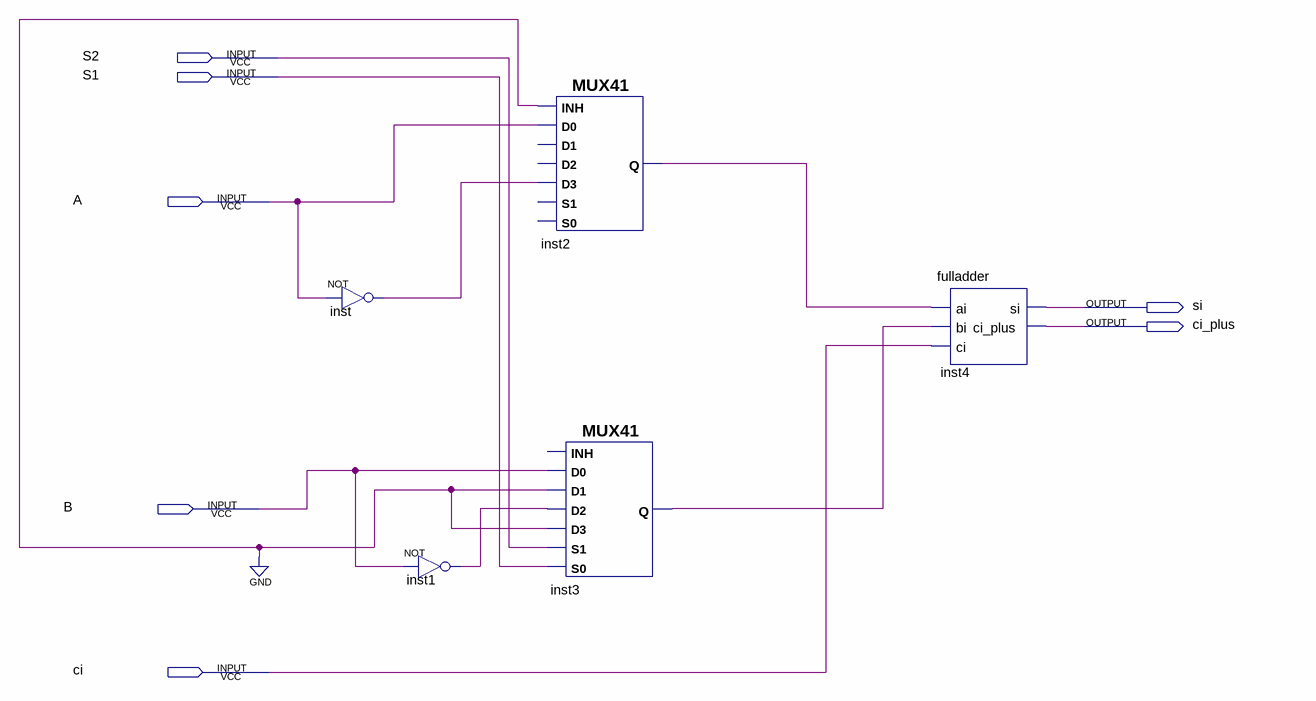
[diagram p0: schematic sheet]
// Quartus schematic arithmeticCircuit1bit.bdf as structural Verilog: 5 symbols, 7 pins
module arithmeticCircuit1bit (
  input  S2,
  input  S1,
  input  A,
  input  B,
  input  ci,
  output si,
  output ci_plus
);

  wire inst1_out, inst2_q, inst3_q, inst_out;

  not inst (inst_out, A);
  not inst1 (inst1_out, B);
  MUX41 inst2 (.D3(inst_out), .D0(A), .INH(1'b0), .Q(inst2_q));  // open: S0, D2, S1, D1
  MUX41 inst3 (.S0(S1), .D2(inst1_out), .S1(S2), .D3(1'b0), .D0(B), .D1(1'b0), .Q(inst3_q));  // open: INH
  fulladder inst4 (.ai(inst2_q), .bi(inst3_q), .ci(ci), .si(si), .ci_plus(ci_plus));
endmodule
